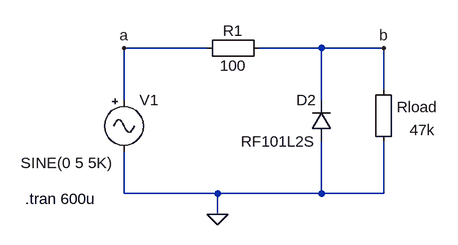
[diagram p0: schematic LD-N6.asc]
LD-N6.asc, the LTspice schematic file:
Version 4
SHEET 1 880 680
WIRE 32 144 -96 144
WIRE 208 144 112 144
WIRE 304 144 208 144
WIRE 304 208 304 144
WIRE -96 224 -96 144
WIRE 208 224 208 144
WIRE -96 368 -96 304
WIRE 48 368 -96 368
WIRE 208 368 208 288
WIRE 208 368 48 368
WIRE 304 368 304 288
WIRE 304 368 208 368
WIRE 48 400 48 368
FLAG -96 144 a
FLAG 304 144 b
FLAG 48 400 0
SYMBOL Misc\\signal -96 208 R0
WINDOW 123 0 0 Left 2
WINDOW 39 0 0 Left 2
WINDOW 3 -159 113 Left 2
SYMATTR Value SINE(0 5 5K)
SYMATTR InstName V1
SYMBOL Misc\\EuropeanResistor 128 128 R90
WINDOW 0 5 56 VBottom 2
WINDOW 3 27 56 VTop 2
SYMATTR InstName R1
SYMATTR Value 100
SYMBOL diode 224 288 R180
WINDOW 3 24 0 Left 2
WINDOW 0 24 64 Left 2
SYMATTR Value RF101L2S
SYMATTR InstName D2
SYMBOL Misc\\EuropeanResistor 320 304 R180
WINDOW 0 -67 69 Left 2
WINDOW 3 -63 34 Left 2
SYMATTR InstName Rload
SYMATTR Value 47k
TEXT -248 376 Left 2 !.tran 600u

The netlist it stands for:
* LD-N6.asc
V1 a 0 SINE(0 5 5K)
R1 b a 100
D2 0 b RF101L2S
Rload 0 b 47k
.model D D
.lib standard.dio
.tran 600u
.backanno
.end